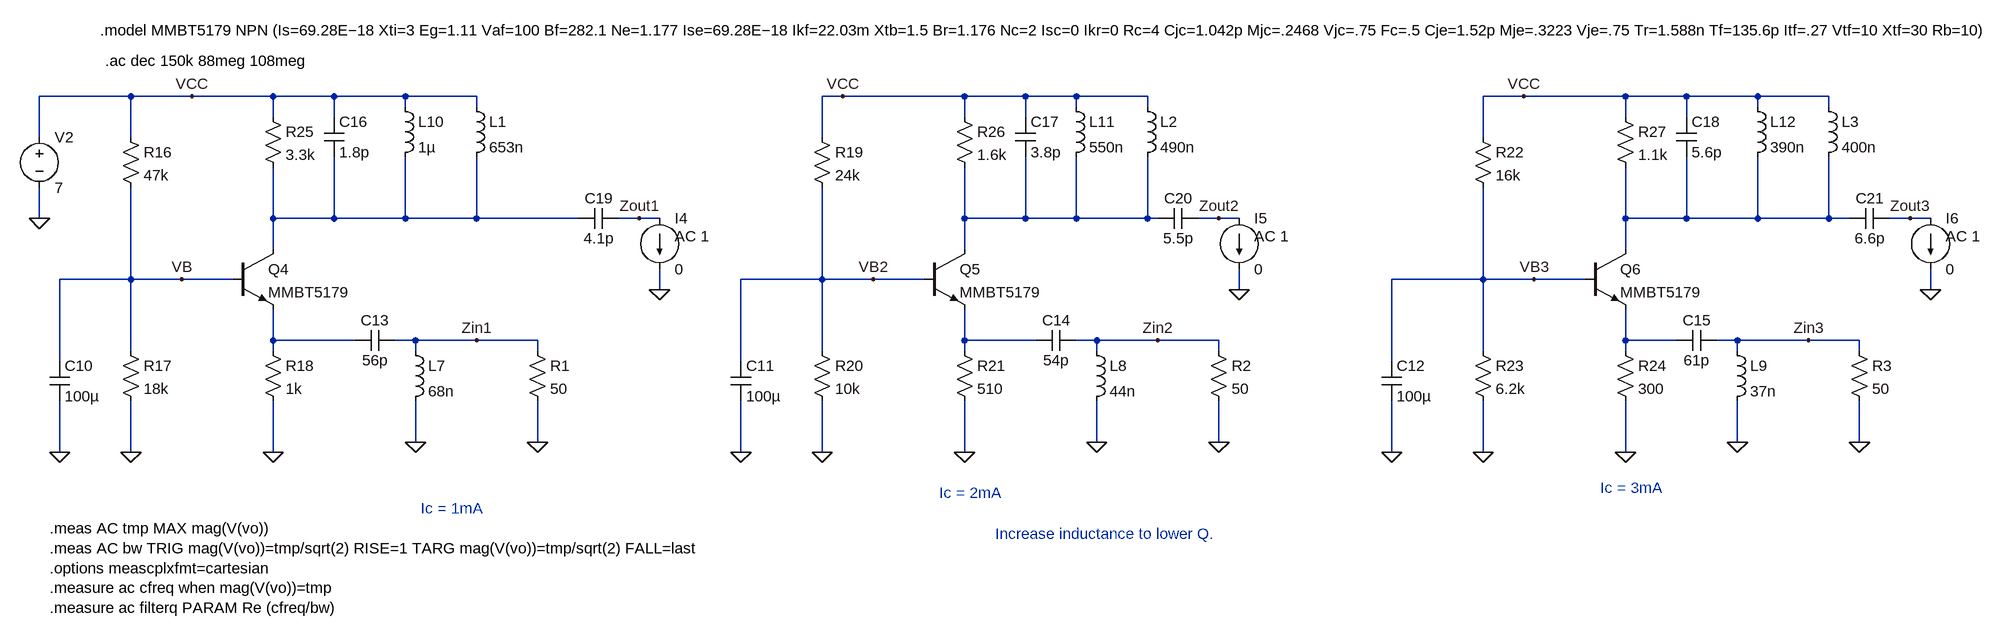
[diagram p0: schematic 7_Output_Match.asc]
7_Output_Match.asc, the LTspice schematic file:
Version 4
SHEET 1 1332 680
WIRE -2416 -944 -2560 -944
WIRE -2320 -944 -2416 -944
WIRE -2192 -944 -2320 -944
WIRE -2096 -944 -2192 -944
WIRE -1984 -944 -2096 -944
WIRE -1872 -944 -1984 -944
WIRE -1296 -944 -1328 -944
WIRE -1104 -944 -1296 -944
WIRE -1008 -944 -1104 -944
WIRE -928 -944 -1008 -944
WIRE -816 -944 -928 -944
WIRE -224 -944 -288 -944
WIRE -64 -944 -224 -944
WIRE 32 -944 -64 -944
WIRE 144 -944 32 -944
WIRE 256 -944 144 -944
WIRE -1984 -928 -1984 -944
WIRE -1872 -928 -1872 -944
WIRE -928 -928 -928 -944
WIRE -816 -928 -816 -944
WIRE 144 -928 144 -944
WIRE 256 -928 256 -944
WIRE -2192 -912 -2192 -944
WIRE -2096 -912 -2096 -944
WIRE -1104 -912 -1104 -944
WIRE -1008 -912 -1008 -944
WIRE -64 -912 -64 -944
WIRE 32 -912 32 -944
WIRE -2560 -880 -2560 -944
WIRE -2416 -880 -2416 -944
WIRE -1328 -880 -1328 -944
WIRE -288 -880 -288 -944
WIRE -2560 -752 -2560 -800
WIRE -2192 -752 -2192 -832
WIRE -2096 -752 -2096 -848
WIRE -2096 -752 -2192 -752
WIRE -1984 -752 -1984 -848
WIRE -1984 -752 -2096 -752
WIRE -1872 -752 -1872 -848
WIRE -1872 -752 -1984 -752
WIRE -1712 -752 -1872 -752
WIRE -1616 -752 -1648 -752
WIRE -1584 -752 -1616 -752
WIRE -1104 -752 -1104 -832
WIRE -1008 -752 -1008 -848
WIRE -1008 -752 -1104 -752
WIRE -928 -752 -928 -848
WIRE -928 -752 -1008 -752
WIRE -816 -752 -816 -848
WIRE -816 -752 -928 -752
WIRE -800 -752 -816 -752
WIRE -704 -752 -736 -752
WIRE -672 -752 -704 -752
WIRE -64 -752 -64 -832
WIRE 32 -752 32 -848
WIRE 32 -752 -64 -752
WIRE 144 -752 144 -848
WIRE 144 -752 32 -752
WIRE 256 -752 256 -848
WIRE 256 -752 144 -752
WIRE 288 -752 256 -752
WIRE 384 -752 352 -752
WIRE 416 -752 384 -752
WIRE -2192 -704 -2192 -752
WIRE -1104 -704 -1104 -752
WIRE -64 -704 -64 -752
WIRE -2416 -656 -2416 -800
WIRE -2416 -656 -2528 -656
WIRE -2336 -656 -2416 -656
WIRE -2256 -656 -2336 -656
WIRE -1328 -656 -1328 -800
WIRE -1328 -656 -1456 -656
WIRE -1248 -656 -1328 -656
WIRE -1168 -656 -1248 -656
WIRE -288 -656 -288 -800
WIRE -288 -656 -432 -656
WIRE -208 -656 -288 -656
WIRE -128 -656 -208 -656
WIRE -1584 -640 -1584 -672
WIRE -672 -640 -672 -672
WIRE 416 -640 416 -672
WIRE -2192 -560 -2192 -608
WIRE -2064 -560 -2192 -560
WIRE -1968 -560 -2000 -560
WIRE -1872 -560 -1968 -560
WIRE -1776 -560 -1872 -560
WIRE -1104 -560 -1104 -608
WIRE -992 -560 -1104 -560
WIRE -896 -560 -928 -560
WIRE -800 -560 -896 -560
WIRE -704 -560 -800 -560
WIRE -64 -560 -64 -608
WIRE 16 -560 -64 -560
WIRE 112 -560 80 -560
WIRE 224 -560 112 -560
WIRE 304 -560 224 -560
WIRE -2416 -544 -2416 -656
WIRE -2192 -544 -2192 -560
WIRE -1968 -544 -1968 -560
WIRE -1776 -544 -1776 -560
WIRE -1328 -544 -1328 -656
WIRE -1104 -544 -1104 -560
WIRE -896 -544 -896 -560
WIRE -704 -544 -704 -560
WIRE -288 -544 -288 -656
WIRE -64 -544 -64 -560
WIRE 112 -544 112 -560
WIRE 304 -544 304 -560
WIRE -2528 -528 -2528 -656
WIRE -1456 -528 -1456 -656
WIRE -432 -528 -432 -656
WIRE -1968 -400 -1968 -464
WIRE -1776 -400 -1776 -464
WIRE -896 -400 -896 -464
WIRE -704 -400 -704 -464
WIRE 112 -400 112 -464
WIRE 304 -400 304 -464
WIRE -2528 -384 -2528 -464
WIRE -2416 -384 -2416 -464
WIRE -2192 -384 -2192 -464
WIRE -1456 -384 -1456 -464
WIRE -1328 -384 -1328 -464
WIRE -1104 -384 -1104 -464
WIRE -432 -384 -432 -464
WIRE -288 -384 -288 -464
WIRE -64 -384 -64 -464
FLAG -2560 -752 0
FLAG -2416 -384 0
FLAG -2192 -384 0
FLAG -2336 -656 VB
FLAG -2320 -944 VCC
FLAG -2528 -384 0
FLAG -1328 -384 0
FLAG -1104 -384 0
FLAG -1248 -656 VB2
FLAG -1296 -944 VCC
FLAG -1456 -384 0
FLAG -288 -384 0
FLAG -64 -384 0
FLAG -208 -656 VB3
FLAG -432 -384 0
FLAG -224 -944 VCC
FLAG -1776 -400 0
FLAG -1968 -400 0
FLAG -704 -400 0
FLAG -896 -400 0
FLAG 304 -400 0
FLAG 112 -400 0
FLAG -1872 -560 Zin1
FLAG -800 -560 Zin2
FLAG 224 -560 Zin3
FLAG -1584 -640 0
FLAG -672 -640 0
FLAG 416 -640 0
FLAG -1616 -752 Zout1
FLAG -704 -752 Zout2
FLAG 384 -752 Zout3
SYMBOL res -2432 -896 R0
SYMATTR InstName R16
SYMATTR Value 47k
SYMBOL res -2432 -560 R0
SYMATTR InstName R17
SYMATTR Value 18k
SYMBOL res -2208 -560 R0
SYMATTR InstName R18
SYMATTR Value 1k
SYMBOL voltage -2560 -896 R0
WINDOW 123 0 0 Left 0
WINDOW 39 0 0 Left 0
SYMATTR InstName V2
SYMATTR Value 7
SYMBOL npn -2256 -704 R0
SYMATTR InstName Q4
SYMATTR Value MMBT5179
SYMBOL cap -2544 -528 R0
SYMATTR InstName C10
SYMATTR Value 100µ
SYMBOL res -1344 -896 R0
SYMATTR InstName R19
SYMATTR Value 24k
SYMBOL res -1344 -560 R0
SYMATTR InstName R20
SYMATTR Value 10k
SYMBOL res -1120 -560 R0
SYMATTR InstName R21
SYMATTR Value 510
SYMBOL npn -1168 -704 R0
SYMATTR InstName Q5
SYMATTR Value MMBT5179
SYMBOL cap -1472 -528 R0
SYMATTR InstName C11
SYMATTR Value 100µ
SYMBOL res -304 -896 R0
SYMATTR InstName R22
SYMATTR Value 16k
SYMBOL res -304 -560 R0
SYMATTR InstName R23
SYMATTR Value 6.2k
SYMBOL res -80 -560 R0
SYMATTR InstName R24
SYMATTR Value 300
SYMBOL npn -128 -704 R0
SYMATTR InstName Q6
SYMATTR Value MMBT5179
SYMBOL cap -448 -528 R0
SYMATTR InstName C12
SYMATTR Value 100µ
SYMBOL cap -2000 -576 R90
WINDOW 0 0 32 VBottom 2
WINDOW 3 32 32 VTop 2
SYMATTR InstName C13
SYMATTR Value 56p
SYMBOL ind -1984 -560 R0
SYMATTR InstName L7
SYMATTR Value 68n
SYMBOL cap -928 -576 R90
WINDOW 0 0 32 VBottom 2
WINDOW 3 32 32 VTop 2
SYMATTR InstName C14
SYMATTR Value 54p
SYMBOL ind -912 -560 R0
SYMATTR InstName L8
SYMATTR Value 44n
SYMBOL cap 80 -576 R90
WINDOW 0 0 32 VBottom 2
WINDOW 3 32 32 VTop 2
SYMATTR InstName C15
SYMATTR Value 61p
SYMBOL ind 96 -560 R0
SYMATTR InstName L9
SYMATTR Value 37n
SYMBOL ind -2000 -944 R0
SYMATTR InstName L10
SYMATTR Value 1µ
SYMBOL cap -2112 -912 R0
SYMATTR InstName C16
SYMATTR Value 1.8p
SYMBOL ind -944 -944 R0
SYMATTR InstName L11
SYMATTR Value 550n
SYMBOL cap -1024 -912 R0
SYMATTR InstName C17
SYMATTR Value 3.8p
SYMBOL ind 128 -944 R0
SYMATTR InstName L12
SYMATTR Value 390n
SYMBOL cap 16 -912 R0
SYMATTR InstName C18
SYMATTR Value 5.6p
SYMBOL current -1584 -752 R0
WINDOW 123 24 28 Left 2
WINDOW 39 0 0 Left 0
SYMATTR Value2 AC 1
SYMATTR InstName I4
SYMATTR Value 0
SYMBOL cap -1648 -768 R90
WINDOW 0 0 32 VBottom 2
WINDOW 3 32 32 VTop 2
SYMATTR InstName C19
SYMATTR Value 4.1p
SYMBOL current -672 -752 R0
WINDOW 123 24 28 Left 2
WINDOW 39 0 0 Left 0
SYMATTR Value2 AC 1
SYMATTR InstName I5
SYMATTR Value 0
SYMBOL cap -736 -768 R90
WINDOW 0 0 32 VBottom 2
WINDOW 3 32 32 VTop 2
SYMATTR InstName C20
SYMATTR Value 5.5p
SYMBOL current 416 -752 R0
WINDOW 123 24 28 Left 2
WINDOW 39 0 0 Left 0
SYMATTR Value2 AC 1
SYMATTR InstName I6
SYMATTR Value 0
SYMBOL cap 352 -768 R90
WINDOW 0 0 32 VBottom 2
WINDOW 3 32 32 VTop 2
SYMATTR InstName C21
SYMATTR Value 6.6p
SYMBOL res -2208 -928 R0
SYMATTR InstName R25
SYMATTR Value 3.3k
SYMBOL res -1120 -928 R0
SYMATTR InstName R26
SYMATTR Value 1.6k
SYMBOL res -80 -928 R0
SYMATTR InstName R27
SYMATTR Value 1.1k
SYMBOL ind -1888 -944 R0
SYMATTR InstName L1
SYMATTR Value 653n
SYMBOL ind -832 -944 R0
SYMATTR InstName L2
SYMATTR Value 490n
SYMBOL ind 240 -944 R0
SYMATTR InstName L3
SYMATTR Value 400n
SYMBOL res -1792 -560 R0
SYMATTR InstName R1
SYMATTR Value 50
SYMBOL res -720 -560 R0
SYMATTR InstName R2
SYMATTR Value 50
SYMBOL res 288 -560 R0
SYMATTR InstName R3
SYMATTR Value 50
TEXT -2464 -1048 Left 2 !.model MMBT5179 NPN (Is=69.28E−18 Xti=3 Eg=1.11 Vaf=100 Bf=282.1 Ne=1.177 Ise=69.28E−18 Ikf=22.03m Xtb=1.5 Br=1.176 Nc=2 Isc=0 Ikr=0 Rc=4 Cjc=1.042p Mjc=.2468 Vjc=.75 Fc=.5 Cje=1.52p Mje=.3223 Vje=.75 Tr=1.588n Tf=135.6p Itf=.27 Vtf=10 Xtf=30 Rb=10)
TEXT -2456 -1000 Left 2 !.ac dec 150k 88meg 108meg
TEXT -1960 -296 Left 2 ;Ic = 1mA
TEXT -1144 -320 Left 2 ;Ic = 2mA
TEXT -104 -328 Left 2 ;Ic = 3mA
TEXT -2544 -264 Left 2 !.meas AC tmp MAX mag(V(vo))\n.meas AC bw TRIG mag(V(vo))=tmp/sqrt(2) RISE=1 TARG mag(V(vo))=tmp/sqrt(2) FALL=last\n.options meascplxfmt=cartesian\n.measure ac cfreq when mag(V(vo))=tmp\n.measure ac filterq PARAM Re (cfreq/bw)
TEXT -1056 -256 Left 2 ;Increase inductance to lower Q.

The netlist it stands for:
* 7_Output_Match.asc
R16 VCC VB 47k
R17 VB 0 18k
R18 N004 0 1k
V2 VCC 0 7
Q4 N001 VB N004 0 MMBT5179
C10 VB 0 100µ
R19 VCC VB2 24k
R20 VB2 0 10k
R21 N005 0 510
Q5 N002 VB2 N005 0 MMBT5179
C11 VB2 0 100µ
R22 VCC VB3 16k
R23 VB3 0 6.2k
R24 N006 0 300
Q6 N003 VB3 N006 0 MMBT5179
C12 VB3 0 100µ
C13 Zin1 N004 56p
L7 Zin1 0 68n
C14 Zin2 N005 54p
L8 Zin2 0 44n
C15 Zin3 N006 61p
L9 Zin3 0 37n
L10 VCC N001 1µ
C16 VCC N001 1.8p
L11 VCC N002 550n
C17 VCC N002 3.8p
L12 VCC N003 390n
C18 VCC N003 5.6p
I4 Zout1 0 0 AC 1
C19 Zout1 N001 4.1p
I5 Zout2 0 0 AC 1
C20 Zout2 N002 5.5p
I6 Zout3 0 0 AC 1
C21 Zout3 N003 6.6p
R25 VCC N001 3.3k
R26 VCC N002 1.6k
R27 VCC N003 1.1k
L1 VCC N001 653n
L2 VCC N002 490n
L3 VCC N003 400n
R1 Zin1 0 50
R2 Zin2 0 50
R3 Zin3 0 50
.model NPN NPN
.model PNP PNP
.lib standard.bjt
.model MMBT5179 NPN (Is=69.28E−18 Xti=3 Eg=1.11 Vaf=100 Bf=282.1 Ne=1.177 Ise=69.28E−18 Ikf=22.03m Xtb=1.5 Br=1.176 Nc=2 Isc=0 Ikr=0 Rc=4 Cjc=1.042p Mjc=.2468 Vjc=.75 Fc=.5 Cje=1.52p Mje=.3223 Vje=.75 Tr=1.588n Tf=135.6p Itf=.27 Vtf=10 Xtf=30 Rb=10)
.ac dec 150k 88meg 108meg
* Ic = 1mA
* Ic = 2mA
* Ic = 3mA
.meas AC tmp MAX mag(V(vo))
.meas AC bw TRIG mag(V(vo))=tmp/sqrt(2) RISE=1 TARG mag(V(vo))=tmp/sqrt(2) FALL=last
.options meascplxfmt=cartesian
.measure ac cfreq when mag(V(vo))=tmp
.measure ac filterq PARAM Re (cfreq/bw)
* Increase inductance to lower Q.
.backanno
.end